# EAGLE design Base (EAGLE 8.6.0)
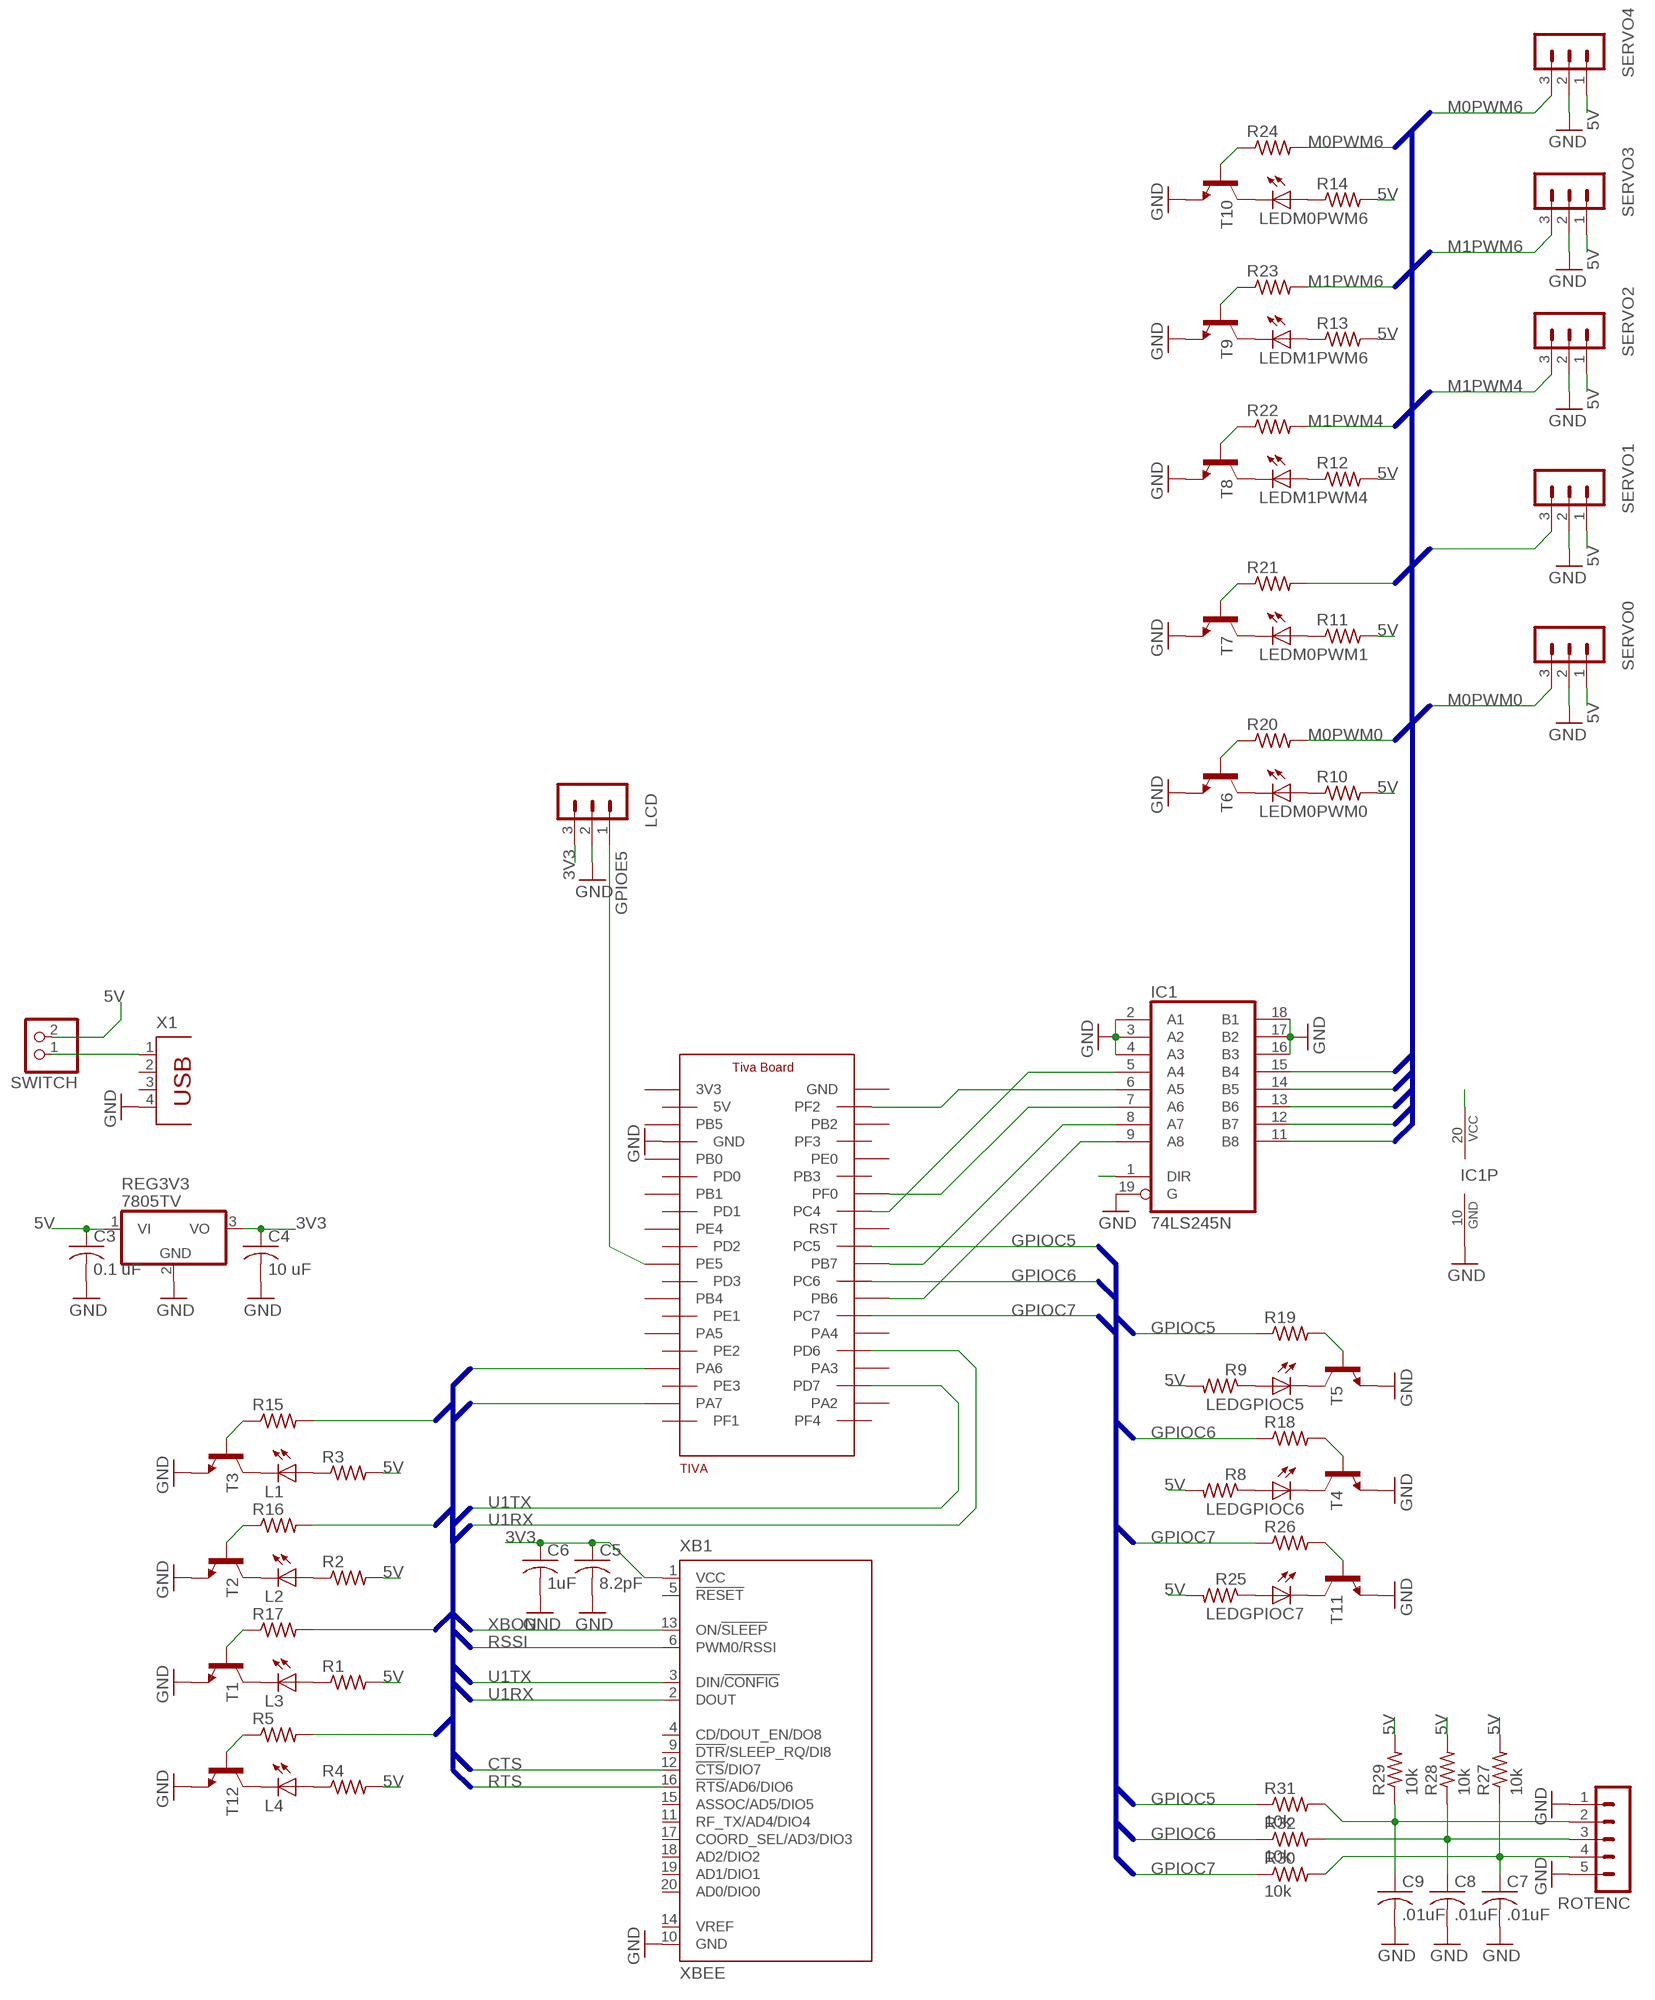
[diagram p0: schematic, sheet 1]

## Parts
C3  0.1 uF  C-US025-025X050  [C025-025X050]
C4  10 uF  C-US025-025X050  [C025-025X050]
C5  8.2pF  C-US025-025X050  [C025-025X050]
C6  1uF  C-US025-025X050  [C025-025X050]
C7  .01uF  C-US025-025X050  [C025-025X050]
C8  .01uF  C-US025-025X050  [C025-025X050]
C9  .01uF  C-US025-025X050  [C025-025X050]
IC1  74LS245N  [DIL20]
L1  LED5MM  [LED5MM]
L2  LED5MM  [LED5MM]
L3  LED5MM  [LED5MM]
L4  LED5MM  [LED5MM]
LCD  MA03-1  [MA03-1]
LEDGPIOC5  LED5MM  [LED5MM]
LEDGPIOC6  LED5MM  [LED5MM]
LEDGPIOC7  LED5MM  [LED5MM]
LEDM0PWM0  LED5MM  [LED5MM]
LEDM0PWM1  LED5MM  [LED5MM]
LEDM0PWM6  LED5MM  [LED5MM]
LEDM1PWM4  LED5MM  [LED5MM]
LEDM1PWM6  LED5MM  [LED5MM]
R1  R-US_0207/7  [0207/7]
R2  R-US_0207/7  [0207/7]
R3  R-US_0207/7  [0207/7]
R4  R-US_0207/7  [0207/7]
R5  R-US_0207/7  [0207/7]
R8  R-US_0207/7  [0207/7]
R9  R-US_0207/7  [0207/7]
R10  R-US_0207/7  [0207/7]
R11  R-US_0207/7  [0207/7]
R12  R-US_0207/7  [0207/7]
R13  R-US_0207/7  [0207/7]
R14  R-US_0207/7  [0207/7]
R15  R-US_0207/7  [0207/7]
R16  R-US_0207/7  [0207/7]
R17  R-US_0207/7  [0207/7]
R18  R-US_0207/7  [0207/7]
R19  R-US_0207/7  [0207/7]
R20  R-US_0207/7  [0207/7]
R21  R-US_0207/7  [0207/7]
R22  R-US_0207/7  [0207/7]
R23  R-US_0207/7  [0207/7]
R24  R-US_0207/7  [0207/7]
R25  R-US_0207/7  [0207/7]
R26  R-US_0207/7  [0207/7]
R27  10k  R-US_0207/7  [0207/7]
R28  10k  R-US_0207/7  [0207/7]
R29  10k  R-US_0207/7  [0207/7]
R30  10k  R-US_0207/7  [0207/7]
R31  10k  R-US_0207/7  [0207/7]
R32  10k  R-US_0207/7  [0207/7]
REG3V3  7805TV  [TO220V]
ROTENC  MA05-1  [MA05-1]
SERVO0  MA03-1  [MA03-1]
SERVO1  MA03-1  [MA03-1]
SERVO2  MA03-1  [MA03-1]
SERVO3  MA03-1  [MA03-1]
SERVO4  MA03-1  [MA03-1]
SWITCH  PINHD-1X2  [1X02]
T1  2N3904  [TO92]
T2  2N3904  [TO92]
T3  2N3904  [TO92]
T4  2N3904  [TO92]
T5  2N3904  [TO92]
T6  2N3904  [TO92]
T7  2N3904  [TO92]
T8  2N3904  [TO92]
T9  2N3904  [TO92]
T10  2N3904  [TO92]
T11  2N3904  [TO92]
T12  2N3904  [TO92]
TIVA  TIVA-BOARD  [TIVA-BOARD]
X1  PN87520  [PN87520]
XB1  XBEE  [XBEE]

## Nets
3V3: C4.1 C5.1 C6.1 LCD.3 REG3V3.3(VO) XB1.1(VCC)
5V: C3.1 IC1.1(DIR) IC1.20(VCC) R1.2 R2.2 R3.2 R4.2 R8.2 R9.2 R10.2 R11.2 R12.2 R13.2 R14.2 R25.2 R27.2 R28.2 R29.2 REG3V3.1(VI) SERVO0.1 SERVO1.1 SERVO2.1 SERVO3.1 SERVO4.1 SWITCH.2
CTS: TIVA.PA6 XB1.12(!CTS!/DIO7)
GND: C3.2 C4.2 C5.2 C6.2 C7.2 C8.2 C9.2 IC1.2(A1) IC1.3(A2) IC1.4(A3) IC1.10(GND) IC1.16(B3) IC1.17(B2) IC1.18(B1) IC1.19(G) LCD.2 REG3V3.2(GND) ROTENC.1 ROTENC.5 SERVO0.2 SERVO1.2 SERVO2.2 SERVO3.2 SERVO4.2 T1.3(E) T2.3(E) T3.3(E) T4.3(E) T5.3(E) T6.3(E) T7.3(E) T8.3(E) T9.3(E) T10.3(E) T11.3(E) T12.3(E) TIVA.GND@1(GND) X1.4 XB1.10(GND)
GPIOC5: R19.1 R31.1 TIVA.PC5
GPIOC6: R18.1 R32.1 TIVA.PC6
GPIOC7: R26.1 R30.1 TIVA.PC7
GPIOE5: LCD.1 TIVA.PE5
M0PWM0: IC1.11(B8) R20.2 SERVO0.3
M0PWM1: IC1.12(B7) R21.2 SERVO1.3
M0PWM6: IC1.15(B4) R24.2 SERVO4.3
M1PWM4: IC1.13(B6) R22.2 SERVO2.3
M1PWM6: IC1.14(B5) R23.2 SERVO3.3
N$1: L3.K(C) T1.1(C)
N$2: L2.K(C) T2.1(C)
N$3: L2.A R2.1
N$4: L3.A R1.1
N$5: L1.K(C) T3.1(C)
N$6: L1.A R3.1
N$7: SWITCH.1 X1.1
N$8: IC1.8(A7) TIVA.PB7
N$9: LEDGPIOC6.K(C) T4.1(C)
N$10: LEDGPIOC6.A R8.1
N$11: LEDGPIOC5.K(C) T5.1(C)
N$12: LEDGPIOC5.A R9.1
N$13: LEDM0PWM0.K(C) T6.1(C)
N$14: LEDM0PWM0.A R10.1
N$15: LEDM0PWM1.K(C) T7.1(C)
N$16: LEDM0PWM1.A R11.1
N$17: LEDM1PWM4.K(C) T8.1(C)
N$18: LEDM1PWM4.A R12.1
N$19: LEDM1PWM6.K(C) T9.1(C)
N$20: LEDM1PWM6.A R13.1
N$21: LEDM0PWM6.K(C) T10.1(C)
N$22: LEDM0PWM6.A R14.1
N$23: R24.1 T10.2(B)
N$24: R23.1 T9.2(B)
N$25: R22.1 T8.2(B)
N$26: R21.1 T7.2(B)
N$27: R20.1 T6.2(B)
N$28: R15.1 T3.2(B)
N$29: R16.1 T2.2(B)
N$30: R17.1 T1.2(B)
N$31: R18.2 T4.2(B)
N$32: R19.2 T5.2(B)
N$33: LEDGPIOC7.K(C) T11.1(C)
N$34: LEDGPIOC7.A R25.1
N$35: R26.2 T11.2(B)
N$36: C7.1 R27.1 R30.2 ROTENC.4
N$37: C8.1 R28.1 R32.2 ROTENC.3
N$38: C9.1 R29.1 R31.2 ROTENC.2
N$39: IC1.9(A8) TIVA.PB6
N$40: IC1.6(A5) TIVA.PF2
N$43: L4.K(C) T12.1(C)
N$44: L4.A R4.1
N$45: R5.1 T12.2(B)
N$46: IC1.7(A6) TIVA.PF0
N$47: IC1.5(A4) TIVA.PC4
RSSI: R5.2 XB1.6(PWM0/RSSI)
RTS: TIVA.PA7 XB1.16(!RTS!/AD6/DIO6)
U1RX: R16.2 TIVA.PD6 XB1.2(DOUT)
U1TX: R17.2 TIVA.PD7 XB1.3(DIN/!CONFIG)
XBON: R15.2 XB1.13(ON/!SLEEP)
Unconnected: TIVA.3.3V(3V3) TIVA.5V TIVA.GND@2(GND) TIVA.PA2 TIVA.PA3 TIVA.PA4 TIVA.PA5 TIVA.PB0 TIVA.PB1 TIVA.PB2 TIVA.PB3 TIVA.PB4 TIVA.PB5 TIVA.PD0 TIVA.PD1 TIVA.PD2 TIVA.PD3 TIVA.PE0 TIVA.PE1 TIVA.PE2 TIVA.PE3 TIVA.PE4 TIVA.PF1 TIVA.PF3 TIVA.PF4 TIVA.RST X1.2 X1.3 XB1.4(CD/DOUT_EN/DO8) XB1.5(!RESET) XB1.9(!DTR!/SLEEP_RQ/DI8) XB1.11(RF_TX/AD4/DIO4) XB1.14(VREF) XB1.15(ASSOC/AD5/DIO5) XB1.17(COORD_SEL/AD3/DIO3) XB1.18(AD2/DIO2) XB1.19(AD1/DIO1) XB1.20(AD0/DIO0)

## Buses
U1RX,U1TX,CTS,RTS,RSSI,XBON
M1PWM6,M1PWM4,M0PWM1,M0PWM6,M0PWM0
GPIOC5,GPIOC6,GPIOC7

## Library data of the parts
C3-C9 = rcl:C-US: CAPACITOR, American symbol
IC1 = 74xx-us:74*245: Octal BUS TRANSCEIVER, 3-state
L1-L4 LEDGPIOC5-LEDGPIOC7 LEDM0PWM0 LEDM0PWM1 LEDM0PWM6 LEDM1PWM4 LEDM1PWM6 = led:LED: LED OSRAM: - CHIPLED LG R971, LG N971, LY N971, LG Q971, LY Q971, LO R971, LY R971 LH N974, LH R974 LS Q976, LO Q976, LY Q976 LO Q996 - Hyper CHIPLED LW Q18S LB Q993, LB Q99A, LB R99A - SideLED LS A670, LO A670, LY A670, LG A670, LP A670 LB A673, LV A673, LT A673, LW A673 LH A674 LY A675 LS A676, LA A676, LO A676, LY A676, LW A676 LS A679, LY A679, LG A679 - Hyper Micro SIDELED® LS Y876, LA Y876, LO Y876, LY Y876 LT Y87S - SmartLED LW L88C, LW L88S LB L89C, LB L89S, LG L890 LS L89K, LO L89K, LY L89K LS L896, LA L896, LO L896, LY L896 - TOPLED LS T670, LO T670, LY T670, LG T670, LP T670 LSG T670, LSP T670, LSY T670, LOP T670, LYG T670 LG T671, LOG T671, LSG T671 LB T673, LV T673, LT T673, LW T673 LH T674 LS T676, LA T676, LO T676, LY T676, LB T676, LH T676, LSB T676, LW T676 LB T67C, LV T67C, LT T67C, LS T67K, LO T67K, LY T67K, LW E67C LS E67B, LA E67B, LO E67B, LY E67B, LB E67C, LV E67C, LT E67C LW T67C LS T679, LY T679, LG T679 LS T770, LO T770, LY T770, LG T770, LP T770 LB T773, LV T773, LT T773, LW T773 LH T774 LS E675, LA E675, LY E675, LS T675 LS T776, LA T776, LO T776, LY T776, LB T776 LHGB T686 LT T68C, LB T68C - Hyper Mini TOPLED® LB M676 - Mini TOPLED Santana® LG M470 LS M47K, LO M47K, LY M47K Source: http://www.osram.convergy.de LUXEON: - LUMILED® LXK2-PW12-R00, LXK2-PW12-S00, LXK2-PW14-U00, LXK2-PW14-V00 LXK2-PM12-R00, LXK2-PM12-S00, LXK2-PM14-U00 LXK2-PE12-Q00, LXK2-PE12-R00, LXK2-PE12-S00, LXK2-PE14-T00, LXK2-PE14-U00 LXK2-PB12-K00, LXK2-PB12-L00, LXK2-PB12-M00, LXK2-PB14-N00, LXK2-PB14-P00, LXK2-PB14-Q00 LXK2-PR12-L00, LXK2-PR12-M00, LXK2-PR14-Q00, LXK2-PR14-R00 LXK2-PD12-Q00, LXK2-PD12-R00, LXK2-PD12-S00 LXK2-PH12-R00, LXK2-PH12-S00 LXK2-PL12-P00, LXK2-PL12-Q00, LXK2-PL12-R00 Source: www.luxeon.com KINGBRIGHT: KA-3528ASYC Source: www.kingbright.com
LCD SERVO0 SERVO1-SERVO4 = con-lstb:MA03-1: PIN HEADER; OC_FARNELL: unknown; OC_NEWARK: unknown
R1-R5 R8-R32 = rcl:R-US_: RESISTOR, American symbol
REG3V3 = linear:78*: Positive VOLTAGE REGULATOR Source: http://cache.national.com/ds/LM/LM78L05.pdf http://www.fairchildsemi.com/ds/LM/LM7805.pdf
ROTENC = con-lstb:MA05-1: PIN HEADER; OC_FARNELL: unknown; OC_NEWARK: unknown
SWITCH = pinhead:PINHD-1X2: PIN HEADER
T1-T12 = transistor:2N3904: NPN TRANSISTOR
TIVA = tiva-board:TIVA-BOARD
X1 = con-berg:PN87520: BERG USB connector; OC_FARNELL: unknown; OC_NEWARK: unknown
XB1 = maxstream:XBEE: XBee (TM) /XBee-PRO(TM) OEM RF Modules Source: MaxStream, Inc. xbee_productmanual.pdf; MPN: XBP24-Z7UIT-004; OC_FARNELL: 1751799; OC_NEWARK: 34R5507

## Board
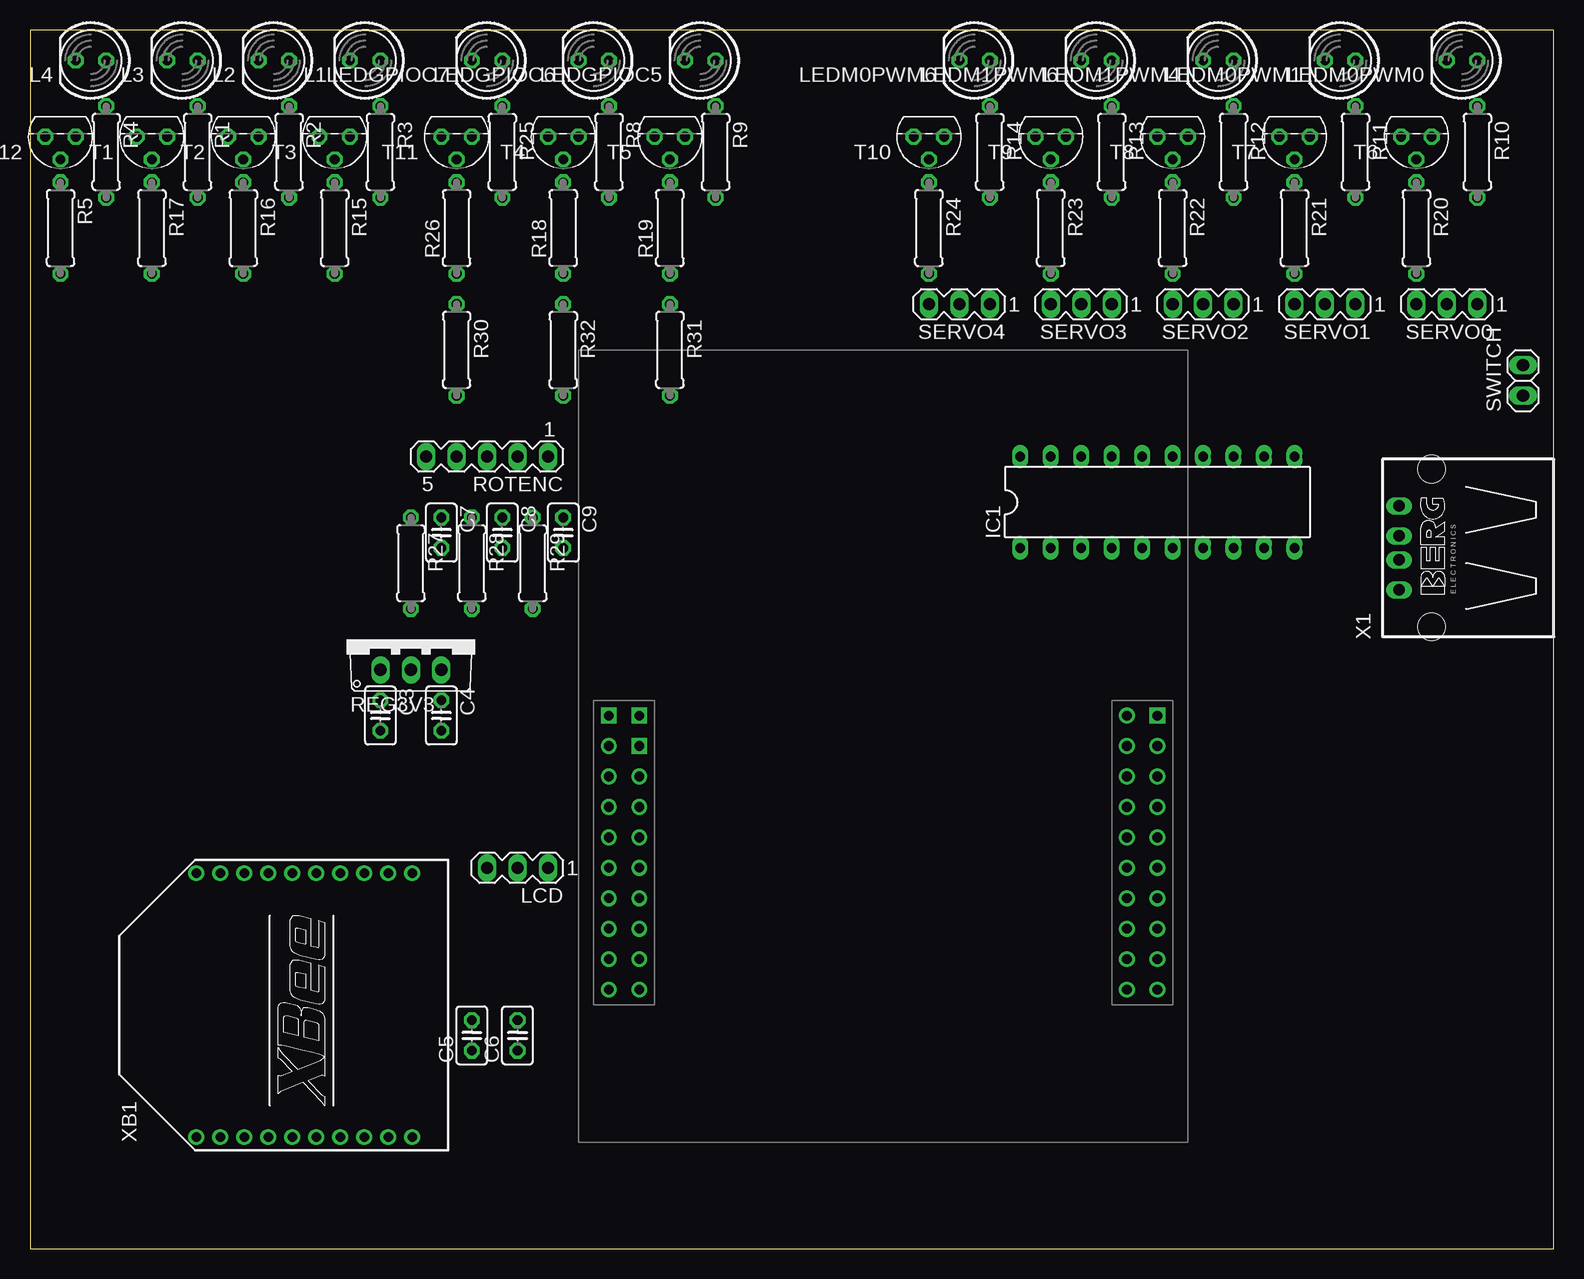
[diagram p1: board, top side]
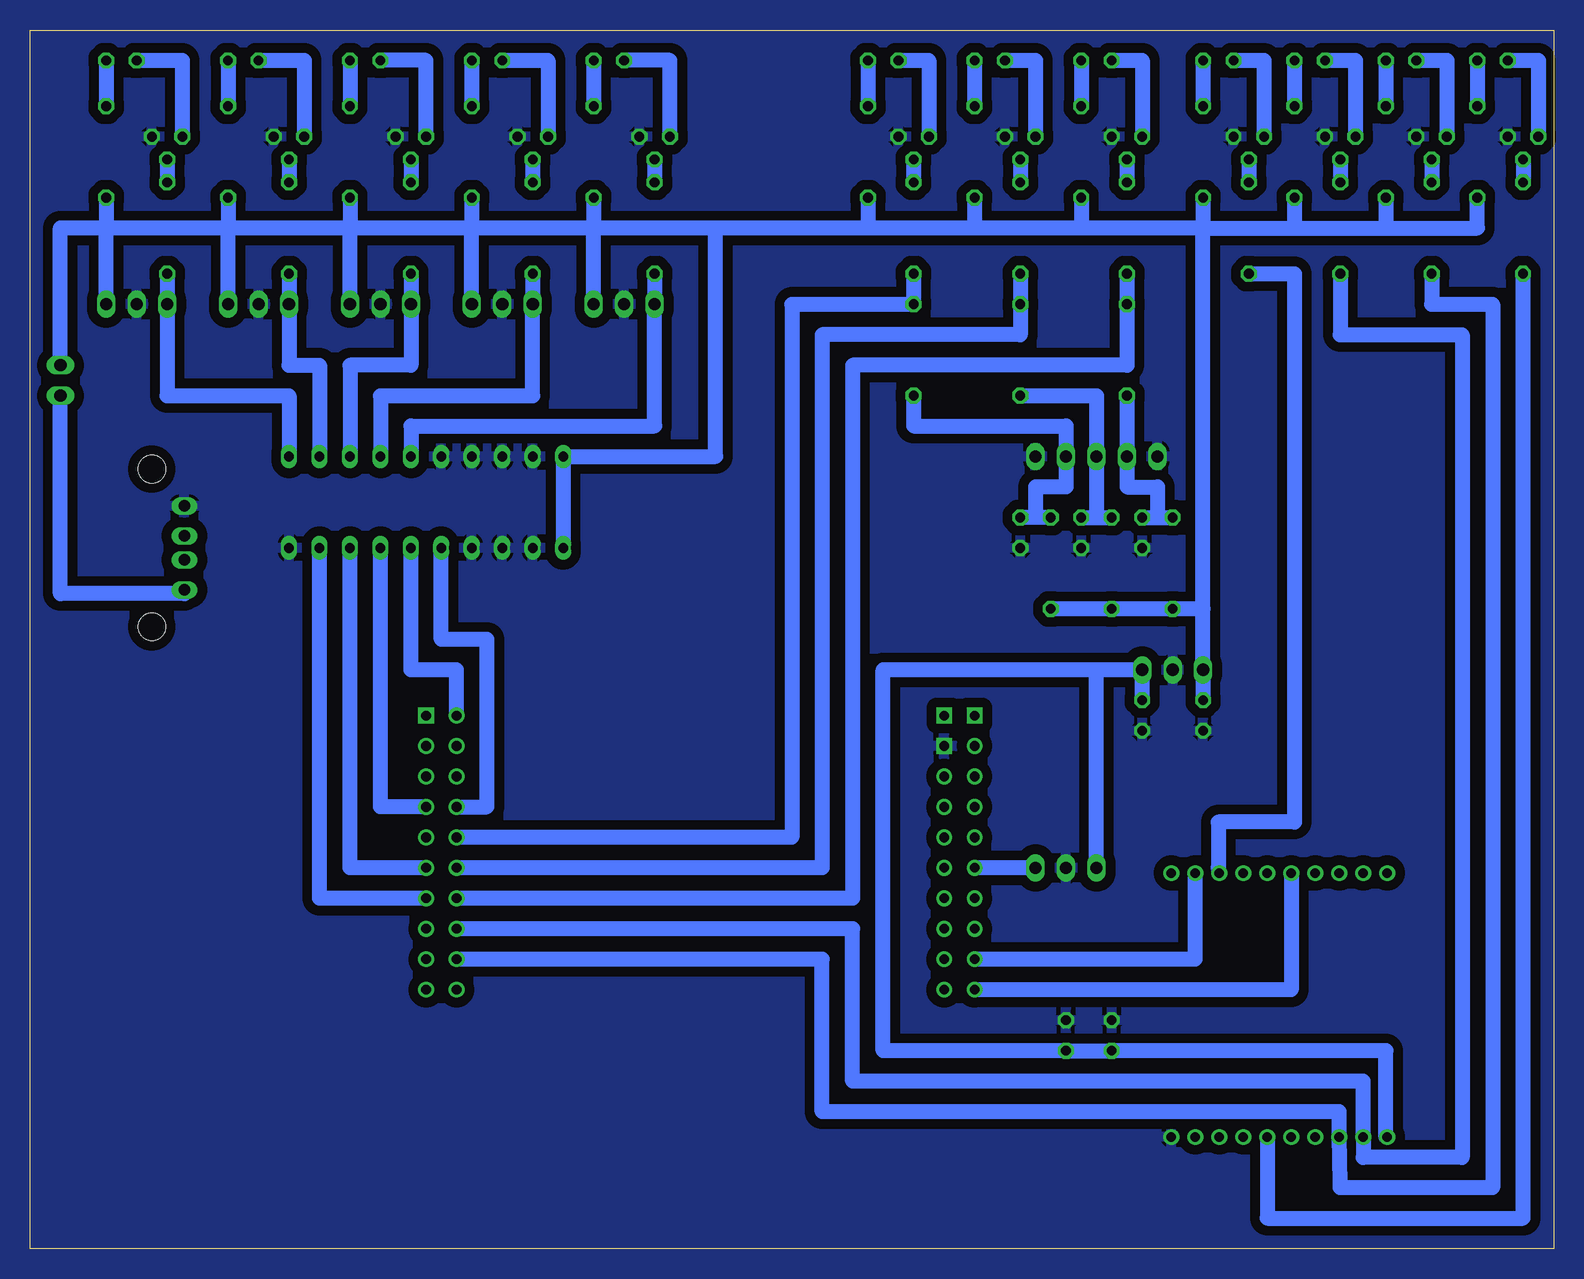
[diagram p2: board, bottom side, seen from below]

Size 127 x 101.6 mm. Coordinates in mm from the lower left corner, seen from the top.
Outline: 0,0 127,0 127,101.6 0,101.6 0,0
Copper layers (1*16): Top 0.035mm / dielectric 1.5mm / Bottom 0.035mm
Design rules "OthermillDRC_1_32_v2": minimum track width 8mil, minimum drill 0.8mm, track to track 0.794003125mm, track to pad 0.794003125mm, pad to pad 0.794003125mm, via to via 0.794003125mm, smd to smd 0mil, copper to edge 0mil, drill to drill 1mil, minimum pad ring 10mil, minimum via ring 10mil, stop-mask expansion 1mil, vias tented up to drill 30mil, thermal gap 10mil

### Footprints (pad centres in the part's own frame; a part is rotated, then mirrored left to right if it is on the bottom)
C025-025X050 = drill 0.813 octagon: 1 -1.27,0; 2 1.27,0
DIL20 = drill 0.813 long: 1 -11.43,-3.81; 2 -8.89,-3.81; 3 -6.35,-3.81; 4 -3.81,-3.81; 5 -1.27,-3.81; 6 1.27,-3.81; 7 3.81,-3.81; 8 6.35,-3.81; 9 8.89,-3.81; 10 11.43,-3.81; 11 11.43,3.81; 12 8.89,3.81; 13 6.35,3.81; 14 3.81,3.81; 15 1.27,3.81; 16 -1.27,3.81; 17 -3.81,3.81; 18 -6.35,3.81; 19 -8.89,3.81; 20 -11.43,3.81
LED5MM = drill 0.813 octagon: A -1.27,0; K 1.27,0
MA03-1 = drill 1.016 long: 1 -2.54,0; 2 0,0; 3 2.54,0
0207/7 = drill 0.813 octagon: 1 -3.81,0; 2 3.81,0
TO220V = drill 1.016 long: 1 -2.54,-2.54; 2 0,-2.54; 3 2.54,-2.54
MA05-1 = drill 1.016 long: 1 -5.08,0; 2 -2.54,0; 3 0,0; 4 2.54,0; 5 5.08,0
1X02 = drill 1.016 long: 1 -1.27,0; 2 1.27,0
TO92 = drill 0.813 octagon: 1 1.27,0; 2 0,1.905; 3 -1.27,0
TIVA-BOARD = drill 0.8 square: 3.3V -22.86,2.54; 5V -20.32,2.54; GND@1 -20.32,0; GND@2 22.86,2.54 | drill 0.8: PA2 22.86,-20.32; PA3 22.86,-17.78; PA4 22.86,-15.24; PA5 -22.86,-15.24; PA6 -22.86,-17.78; PA7 -22.86,-20.32; PB0 -22.86,-2.54; PB1 -22.86,-5.08; PB2 22.86,0; PB3 20.32,-2.54; PB4 -22.86,-12.7; PB5 -22.86,0; PB6 22.86,-12.7; PB7 22.86,-10.16; PC4 20.32,-5.08; PC5 20.32,-7.62; PC6 20.32,-10.16; PC7 20.32,-12.7; PD0 -20.32,-2.54; PD1 -20.32,-5.08; PD2 -20.32,-7.62; PD3 -20.32,-10.16; PD6 20.32,-15.24; PD7 20.32,-17.78; PE0 22.86,-2.54; PE1 -20.32,-12.7; PE2 -20.32,-15.24; PE3 -20.32,-17.78; PE4 -22.86,-7.62; PE5 -22.86,-10.16; PF0 22.86,-5.08; PF1 -20.32,-20.32; PF2 20.32,2.54; PF3 20.32,0; PF4 20.32,-20.32; RST 22.86,-7.62
PN87520 = drill 0.95 long: 1 -3.5,2.71; 2 -1,2.71; 3 1,2.71; 4 3.5,2.71 | hole 2.3: -6.57,0; 6.57,0
XBEE = drill 0.8 pad 1.27: 1 -11,9; 2 -11,7; 3 -11,5; 4 -11,3; 5 -11,1; 6 -11,-1; 7 -11,-3; 8 -11,-5; 9 -11,-7; 10 -11,-9; 11 11,-9; 12 11,-7; 13 11,-5; 14 11,-3; 15 11,-1; 16 11,1; 17 11,3; 18 11,5; 19 11,7; 20 11,9

### Placement (x,y rotation side)
C3  29.21,44.45 270 top
C4  34.29,44.45 270 top
C5  36.83,17.78 90 top
C6  40.64,17.78 90 top
C7  34.29,59.69 270 top
C8  39.37,59.69 270 top
C9  44.45,59.69 270 top
IC1  93.98,62.23 0 top
L1  27.94,99.06 180 top
L2  20.32,99.06 180 top
L3  12.7,99.06 180 top
L4  5.08,99.06 180 top
LCD  40.64,31.75 180 top
LEDGPIOC5  55.88,99.06 180 top
LEDGPIOC6  46.99,99.06 180 top
LEDGPIOC7  38.1,99.06 180 top
LEDM0PWM0  119.38,99.06 180 top
LEDM0PWM1  109.22,99.06 180 top
LEDM0PWM6  78.74,99.06 180 top
LEDM1PWM4  99.06,99.06 180 top
LEDM1PWM6  88.9,99.06 180 top
R1  13.97,91.44 270 top
R2  21.59,91.44 270 top
R3  29.21,91.44 270 top
R4  6.35,91.44 270 top
R5  2.54,85.09 270 top
R8  48.26,91.44 270 top
R9  57.15,91.44 270 top
R10  120.65,91.44 270 top
R11  110.49,91.44 270 top
R12  100.33,91.44 270 top
R13  90.17,91.44 270 top
R14  80.01,91.44 270 top
R15  25.4,85.09 270 top
R16  17.78,85.09 270 top
R17  10.16,85.09 270 top
R18  44.45,85.09 90 top
R19  53.34,85.09 90 top
R20  115.57,85.09 270 top
R21  105.41,85.09 270 top
R22  95.25,85.09 270 top
R23  85.09,85.09 270 top
R24  74.93,85.09 270 top
R25  39.37,91.44 270 top
R26  35.56,85.09 90 top
R27  31.75,57.15 270 top
R28  36.83,57.15 270 top
R29  41.91,57.15 270 top
R30  35.56,74.93 270 top
R31  53.34,74.93 270 top
R32  44.45,74.93 270 top
REG3V3  31.75,50.8 0 top
ROTENC  38.1,66.04 180 top
SERVO0  118.11,78.74 180 top
SERVO1  107.95,78.74 180 top
SERVO2  97.79,78.74 180 top
SERVO3  87.63,78.74 180 top
SERVO4  77.47,78.74 180 top
SWITCH  124.46,72.39 90 top
T1  10.16,92.71 180 top
T2  17.78,92.71 180 top
T3  25.4,92.71 180 top
T4  44.45,92.71 180 top
T5  53.34,92.71 180 top
T6  115.57,92.71 180 top
T7  105.41,92.71 180 top
T8  95.25,92.71 180 top
T9  85.09,92.71 180 top
T10  74.93,92.71 180 top
T11  35.56,92.71 180 top
T12  2.54,92.71 180 top
TIVA  71.12,41.91 0 top
X1  116.84,58.42 90 top
XB1  22.86,20.32 90 top

### Tracks (layer width: path | path; a pad name or v marks a point on that pad's centre or on a via)
3V3
  Bottom 1.27: C4.1 REG3V3.3 38.1,48.26 | 38.1,48.26 55.88,48.26 55.88,16.51 C6.1 C5.1 13.97,16.51 13.97,9.32 XB1.1 | LCD.3 38.1,48.26
5V
  Bottom 1.27: 29.21,85.09 39.37,85.09 | 39.37,85.09 48.26,85.09 | 48.26,85.09 57.15,85.09 | 57.15,85.09 69.85,85.09 | 69.85,85.09 80.01,85.09 | 80.01,85.09 90.17,85.09 | 90.17,85.09 100.33,85.09 | 100.33,85.09 110.49,85.09 | 110.49,85.09 120.65,85.09 | 120.65,85.09 124.46,85.09 SWITCH.2 | 29.21,53.34 29.21,85.09 | 29.21,53.34 R27.2 R28.2 R29.2 | 69.85,85.09 69.85,66.04 IC1.20 IC1.1 | 29.21,53.34 REG3V3.1 C3.1 | 29.21,85.09 21.59,85.09 | 21.59,85.09 13.97,85.09 | 13.97,85.09 6.35,85.09 R4.2 | R1.2 13.97,85.09 | R2.2 21.59,85.09 | R3.2 29.21,85.09 | R25.2 39.37,85.09 | R8.2 48.26,85.09 | R9.2 57.15,85.09 | R14.2 80.01,85.09 | SERVO4.1 80.01,85.09 | R13.2 90.17,85.09 | SERVO3.1 90.17,85.09 | SERVO2.1 100.33,85.09 | R12.2 100.33,85.09 | R11.2 110.49,85.09 | SERVO1.1 110.49,85.09 | R10.2 120.65,85.09 | SERVO0.1 120.65,85.09
CTS
  Bottom 1.27: TIVA.PA6 29.86,24.13 XB1.12
GND
  pour Bottom (isolate 0.813): -2.54,-2.54 129.54,-2.54 129.54,104.14 -2.54,104.14
GPIOC5
  Bottom 1.27: R19.1 R31.1 63.5,78.74 63.5,34.29 TIVA.PC5
GPIOC6
  Bottom 1.27: R18.1 R32.1 44.45,76.2 60.96,76.2 60.96,31.75 TIVA.PC6
GPIOC7
  Bottom 1.27: R26.1 R30.1 35.56,73.66 58.42,73.66 58.42,29.21 TIVA.PC7
GPIOE5
  Bottom 1.27: LCD.1 TIVA.PE5
M0PWM0
  Bottom 1.27: R20.2 SERVO0.3 115.57,71.12 105.41,71.12 IC1.11
M0PWM1
  Bottom 1.27: R21.2 SERVO1.3 105.41,73.66 102.87,73.66 IC1.12
M0PWM6
  Bottom 1.27: R24.2 SERVO4.3 74.93,68.58 95.25,68.58 IC1.15
M1PWM4
  Bottom 1.27: R22.2 SERVO2.3 95.25,73.66 100.33,73.66 IC1.13
M1PWM6
  Bottom 1.27: R23.2 SERVO3.3 85.09,71.12 97.79,71.12 IC1.14
N$1
  Bottom 1.27: L3.K 8.89,99.06 T1.1
N$2
  Bottom 1.27: L2.K 16.51,99.06 T2.1
N$3
  Bottom 1.27: L2.A R2.1
N$4
  Bottom 1.27: L3.A R1.1
N$5
  Bottom 1.27: L1.K 24.13,99.06 T3.1
N$6
  Bottom 1.27: L1.A R3.1
N$7
  Bottom 1.27: X1.1 114.13,54.61 124.46,54.61 SWITCH.1
N$8
  Bottom 1.27: TIVA.PB7 100.33,31.75 IC1.8
N$9
  Bottom 1.27: LEDGPIOC6.K 43.18,99.06 T4.1
N$10
  Bottom 1.27: LEDGPIOC6.A R8.1
N$11
  Bottom 1.27: LEDGPIOC5.K 52.07,99.06 T5.1
N$12
  Bottom 1.27: LEDGPIOC5.A R9.1
N$13
  Bottom 1.27: LEDM0PWM0.K 114.3,99.06 T6.1
N$14
  Bottom 1.27: LEDM0PWM0.A R10.1
N$15
  Bottom 1.27: LEDM0PWM1.K 104.14,99.06 T7.1
N$16
  Bottom 1.27: LEDM0PWM1.A R11.1
N$17
  Bottom 1.27: T8.1 93.98,99.06 LEDM1PWM4.K
N$18
  Bottom 1.27: LEDM1PWM4.A R12.1
N$19
  Bottom 1.27: LEDM1PWM6.K 83.82,99.06 T9.1
N$20
  Bottom 1.27: LEDM1PWM6.A R13.1
N$21
  Bottom 1.27: T10.1 73.66,99.06 LEDM0PWM6.K
N$22
  Bottom 1.27: LEDM0PWM6.A R14.1
N$23
  Bottom 1.27: T10.2 R24.1
N$24
  Bottom 1.27: T9.2 R23.1
N$25
  Bottom 1.27: T8.2 R22.1
N$26
  Bottom 1.27: T7.2 R21.1
N$27
  Bottom 1.27: T6.2 R20.1
N$28
  Bottom 1.27: T3.2 R15.1
N$29
  Bottom 1.27: T2.2 R16.1
N$30
  Bottom 1.27: T1.2 R17.1
N$31
  Bottom 1.27: T4.2 R18.2
N$32
  Bottom 1.27: T5.2 R19.2
N$33
  Bottom 1.27: LEDGPIOC7.K 34.29,99.06 T11.1
N$34
  Bottom 1.27: LEDGPIOC7.A R25.1
N$35
  Bottom 1.27: T11.2 R26.2
N$36
  Bottom 1.27: R30.2 ROTENC.4 35.56,63.5 33.02,63.5 33.02,60.96 | C7.1 33.02,60.96 | 33.02,60.96 R27.1
N$37
  Bottom 1.27: R32.2 38.1,71.12 ROTENC.3 38.1,60.96 | 38.1,60.96 R28.1 | C8.1 38.1,60.96
N$38
  Bottom 1.27: R31.2 53.34,68.58 40.64,68.58 ROTENC.2 40.64,63.5 43.18,63.5 43.18,60.96 | R29.1 43.18,60.96 | 43.18,60.96 C9.1
N$39
  Bottom 1.27: TIVA.PB6 102.87,29.21 IC1.9
N$40
  Bottom 1.27: TIVA.PF2 91.44,48.26 95.25,48.26 IC1.6
N$43
  Bottom 1.27: L4.K 1.27,99.06 T12.1
N$44
  Bottom 1.27: L4.A R4.1
N$45
  Bottom 1.27: T12.2 R5.1
N$46
  Bottom 1.27: TIVA.PF0 97.79,36.83 IC1.7
N$47
  Bottom 1.27: TIVA.PC4 88.9,36.83 88.9,50.8 92.71,50.8 IC1.5
RSSI
  Bottom 1.27: XB1.6 23.86,2.54 2.54,2.54 R5.2
RTS
  Bottom 1.27: XB1.16 21.86,21.59 TIVA.PA7
U1RX
  Bottom 1.27: R16.2 17.78,76.2 7.62,76.2 7.62,7.62 15.86,7.62 XB1.2 15.86,13.97 58.42,13.97 58.42,26.67 TIVA.PD6
U1TX
  Bottom 1.27: R17.2 10.16,78.74 5.08,78.74 5.08,5.08 17.78,5.08 17.78,5.51 XB1.3 17.86,11.43 60.96,11.43 60.96,24.13 TIVA.PD7
XBON
  Bottom 1.27: R15.2 21.59,81.28 21.59,35.56 27.94,35.56 27.94,31.75 arc-5 XB1.13